# Altium schematic sheet PLC_NanoPI.SchDoc
size A4
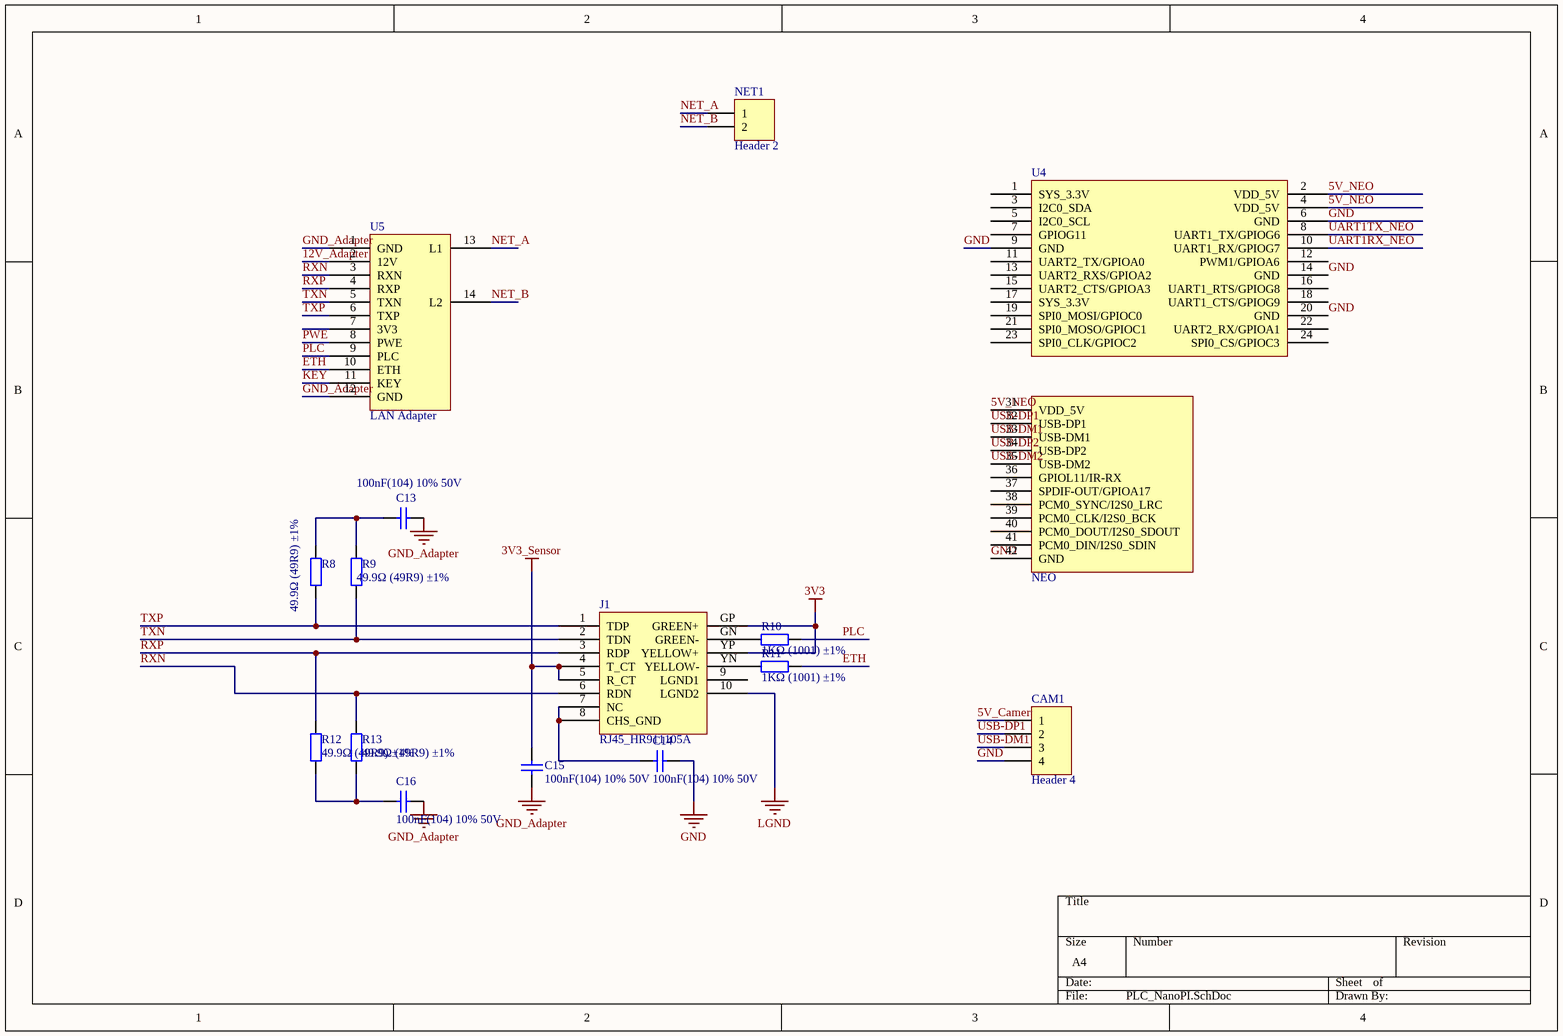
[diagram p0: PLC_NanoPI.SchDoc]

## Parts
C13  100nF(104) 10% 50V  [0603_C]
C14  100nF(104) 10% 50V  [0603-cap]
C15  100nF(104) 10% 50V  [0603_C]
C16  100nF(104) 10% 50V  [0603_C]
CAM1  Header 4  [XH2.54_4P]
J1  RJ45_HR911105A  [RJ45_3]
NET1  Header 2  [XH2.54_2P]
R8  49.9Ω (49R9) ±1%  [0603_R]
R9  49.9Ω (49R9) ±1%  [0603_R]
R10  1KΩ (1001) ±1%  [0603_R]
R11  1KΩ (1001) ±1%  [0603_R]
R12  49.9Ω (49R9) ±1%  [0603_R]
R13  49.9Ω (49R9) ±1%  [0603_R]
U4  NEO  [NanoPiNEO]
U5  LAN Adapter  [LAN Adapter]

## Nets
3V3: J1.GP(GREEN+) J1.YP(YELLOW+)
3V3_Sensor: C15.2 J1.4(T_CT) J1.5(R_CT)
GND: C14.1 CAM1.4 U4.6(GND) U4.9(GND) U4.14(GND) U4.20(GND) U4.42(GND)
GND_Adapter: C13.1 C15.1 C16.1 U5.1(GND) U5.12(GND)
LGND: J1.10(LGND2)
5V_Camera: CAM1.1
5V_NEO: U4.2(VDD_5V) U4.4(VDD_5V) U4.31(VDD_5V)
12V_Adapter: U5.2(12V)
ETH: R11.2 U5.10(ETH)
KEY: U5.11(KEY)
NET_A: NET1.1 U5.13(L1)
NET_B: NET1.2 U5.14(L2)
PLC: R10.2 U5.9(PLC)
PWE: U5.8(PWE)
RXN: J1.6(RDN) R13.2 U5.3(RXN)
RXP: J1.3(RDP) R12.2 U5.4(RXP)
TXN: J1.2(TDN) R9.1 U5.5(TXN)
TXP: J1.1(TDP) R8.1 U5.6(TXP)
UART1RX_NEO: U4.10(UART1_RX/GPIOG7)
UART1TX_NEO: U4.8(UART1_TX/GPIOG6)
USB-DM1: CAM1.3 U4.33(USB-DM1)
USB-DM2: U4.35(USB-DM2)
USB-DP1: CAM1.2 U4.32(USB-DP1)
USB-DP2: U4.34(USB-DP2)
NetC13_2: C13.2 R8.2 R9.2
NetC14_2: C14.2 J1.7(NC) J1.8(CHS_GND)
NetC16_2: C16.2 R12.1 R13.1
NetJ1_GN: J1.GN(GREEN-) R10.1
NetJ1_YN: J1.YN(YELLOW-) R11.1

Not connected (* = marked no-connect by the designer): J1 9(LGND1); U4 1(SYS_3.3V) 3(I2C0_SDA) 5(I2C0_SCL) 7(GPIOG11) 11(UART2_TX/GPIOA0) 12(PWM1/GPIOA6) 13(UART2_RXS/GPIOA2) 15(UART2_CTS/GPIOA3) 16(UART1_RTS/GPIOG8) 17(SYS_3.3V) 18(UART1_CTS/GPIOG9) 19(SPI0_MOSI/GPIOC0) 21(SPI0_MOSO/GPIOC1) 22(UART2_RX/GPIOA1) 23(SPI0_CLK/GPIOC2) 24(SPI0_CS/GPIOC3) 36(GPIOL11/IR-RX) 37(SPDIF-OUT/GPIOA17) 38(PCM0_SYNC/I2S0_LRC) 39(PCM0_CLK/I2S0_BCK) 40(PCM0_DOUT/I2S0_SDOUT) 41(PCM0_DIN/I2S0_SDIN); U5 7(3V3)

## Library data of the parts
C13-C16 = 0805 100nF(104) 10% 50V: 贴片电容; ComponentLink1Description: 供应商链接; ComponentLink1URL: http://www.szlcsc.com/product/details_50686.html; Package: 0805; Supplier: LC; SuppliersPartNumber: C49678
CAM1 = Header 4: Header, 4-Pin; LatestRevisionDate: 17-Jul-2002; LatestRevisionNote: Re-released for DXP Platform.; Publisher: Altium Limited
NET1 = Header 2: Header, 2-Pin; LatestRevisionDate: 17-Jul-2002; LatestRevisionNote: Re-released for DXP Platform.; Publisher: Altium Limited
R8 R9 R12 R13 = 0805 49.9Ω (49R9) 1%: 贴片电阻; ComponentLink1Description: 供应商链接; ComponentLink1URL: http://www.szlcsc.com/product/details_18408.html; Package: 0805; Supplier: LC; SuppliersPartNumber: C17720
R10 R11 = 0603 1KΩ (1001) 1%: 贴片电阻; ComponentLink1Description: 供应商链接; ComponentLink1URL: http://www.szlcsc.com/product/details_21904.html; Package: 0603; Supplier: LC; SuppliersPartNumber: C21190
U4 = NanoPiNEO